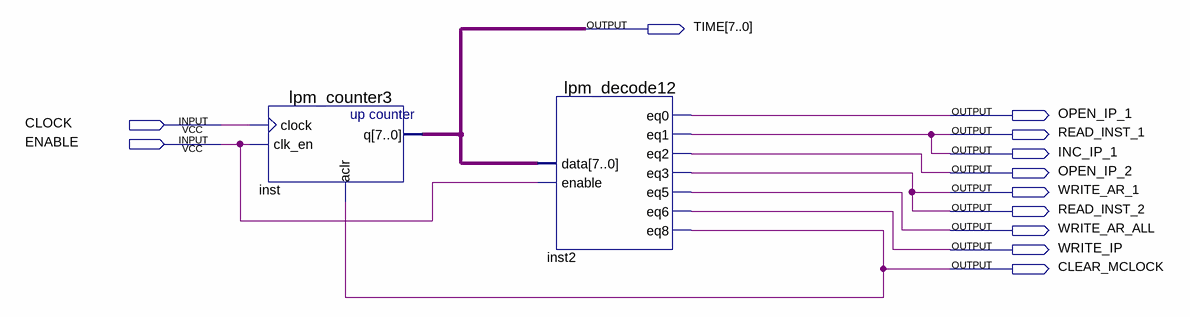
[diagram p0: schematic sheet]
// Quartus schematic JMP.bdf as structural Verilog: 2 symbols, 12 pins
module JMP (
  input  CLOCK,
  input  ENABLE,
  output [7:0] TIME,
  output OPEN_IP_1,
  output READ_INST_1,
  output INC_IP_1,
  output OPEN_IP_2,
  output WRITE_AR_1,
  output READ_INST_2,
  output WRITE_AR_ALL,
  output WRITE_IP,
  output CLEAR_MCLOCK
);

  lpm_counter3 inst (.clock(CLOCK), .clk_en(ENABLE), .aclr(CLEAR_MCLOCK), .q(TIME));
  lpm_decode12 inst2 (
    .data(TIME), .enable(ENABLE), .eq0(OPEN_IP_1), .eq1(INC_IP_1), .eq2(OPEN_IP_2), .eq3(READ_INST_2),
    .eq5(WRITE_AR_ALL), .eq6(WRITE_IP), .eq8(CLEAR_MCLOCK));

  assign READ_INST_1 = INC_IP_1;
  assign WRITE_AR_1 = READ_INST_2;
endmodule
